# Altium schematic sheet 1000524_1.SchDoc: see variant params
size Tabloid; CompanyName: Synapse Wireless Inc.; DrawnBy: <name>; Engineer: <name>; Address1: 6723 Odyssey Drive; Address2: Huntsville, AL 35806; Revision: see variant parameters; SheetNumber: 1; SheetTotal: 1; DocumentTitle: see variant params; SchematicNumber: see variant parameters; AssemblyName: see variant parameters; PCBArevision: see variant parameters
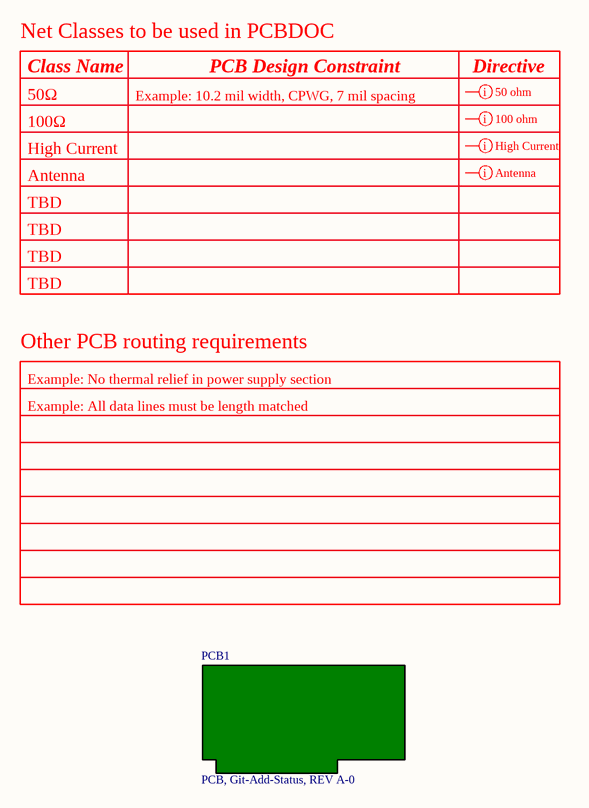
[diagram p0: 1000524_1.SchDoc]

## Parts
PCB1  PCB, Git-Add-Status, REV A-0  (mechanical)

## Layout directives
net class 50 ohm: (no net found under the mark)
net class 100 ohm: (no net found under the mark)
net class High Current: (no net found under the mark)
net class Antenna: (no net found under the mark)

## Notes on the sheet
- Net Classes to be used in PCBDOC
- 50Ω
- Class Name
- Example: 10.2 mil width, CPWG, 7 mil spacing
- PCB Design Constraint
- Directive
- 100Ω
- High Current
- Antenna
- TBD
- Other PCB routing requirements
- Example: No thermal relief in power supply section
- Example: All data lines must be length matched
- This document contains proprietary information and such information
- PROPRIETARY NOTICE
- may not be disclosed to others for any purpose or used for
- manufacturing purposes without written permission from Synapse
- Wireless Inc.
- The United States Government and other recipients shall not be
- bound by this restriction to the extent they have by written contract
- Synapse Wireless Inc.
- 6723 Odyssey Drive
- Huntsville, AL
- 35806
- acquired greater rights.
- 256-852-7888

## Library data of the parts
PCB1 = PCB2-A.1: Bare PCB; PART NUMBER: 1000524; MFG: SYNAPSE; MFG PART NUMBER: 1000524; PART DESCRIPTION: PCB, Git-Add-Status, REV A-0; DESIGN NOTE: -; PRICE: ?; BOM NOTE: -; PART TYPE: PCB